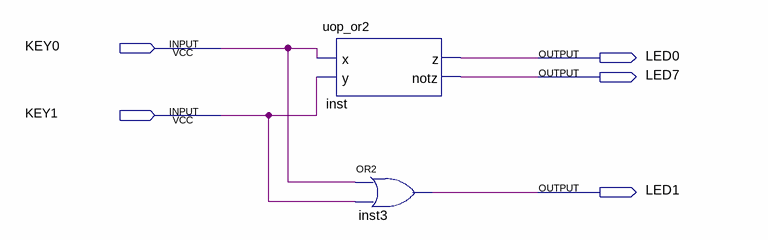
[diagram p0: schematic sheet]
// Quartus schematic comb_logic.bdf as structural Verilog: 2 symbols, 5 pins
module comb_logic (
  input  KEY0,
  input  KEY1,
  output LED0,
  output LED7,
  output LED1
);

  uop_or2 inst (.x(KEY0), .y(KEY1), .z(LED0), .notz(LED7));
  or inst3 (LED1, KEY0, KEY1);
endmodule
